# EAGLE schematic PDB (EAGLE 7.6.0)

## Sheet 1 of 2
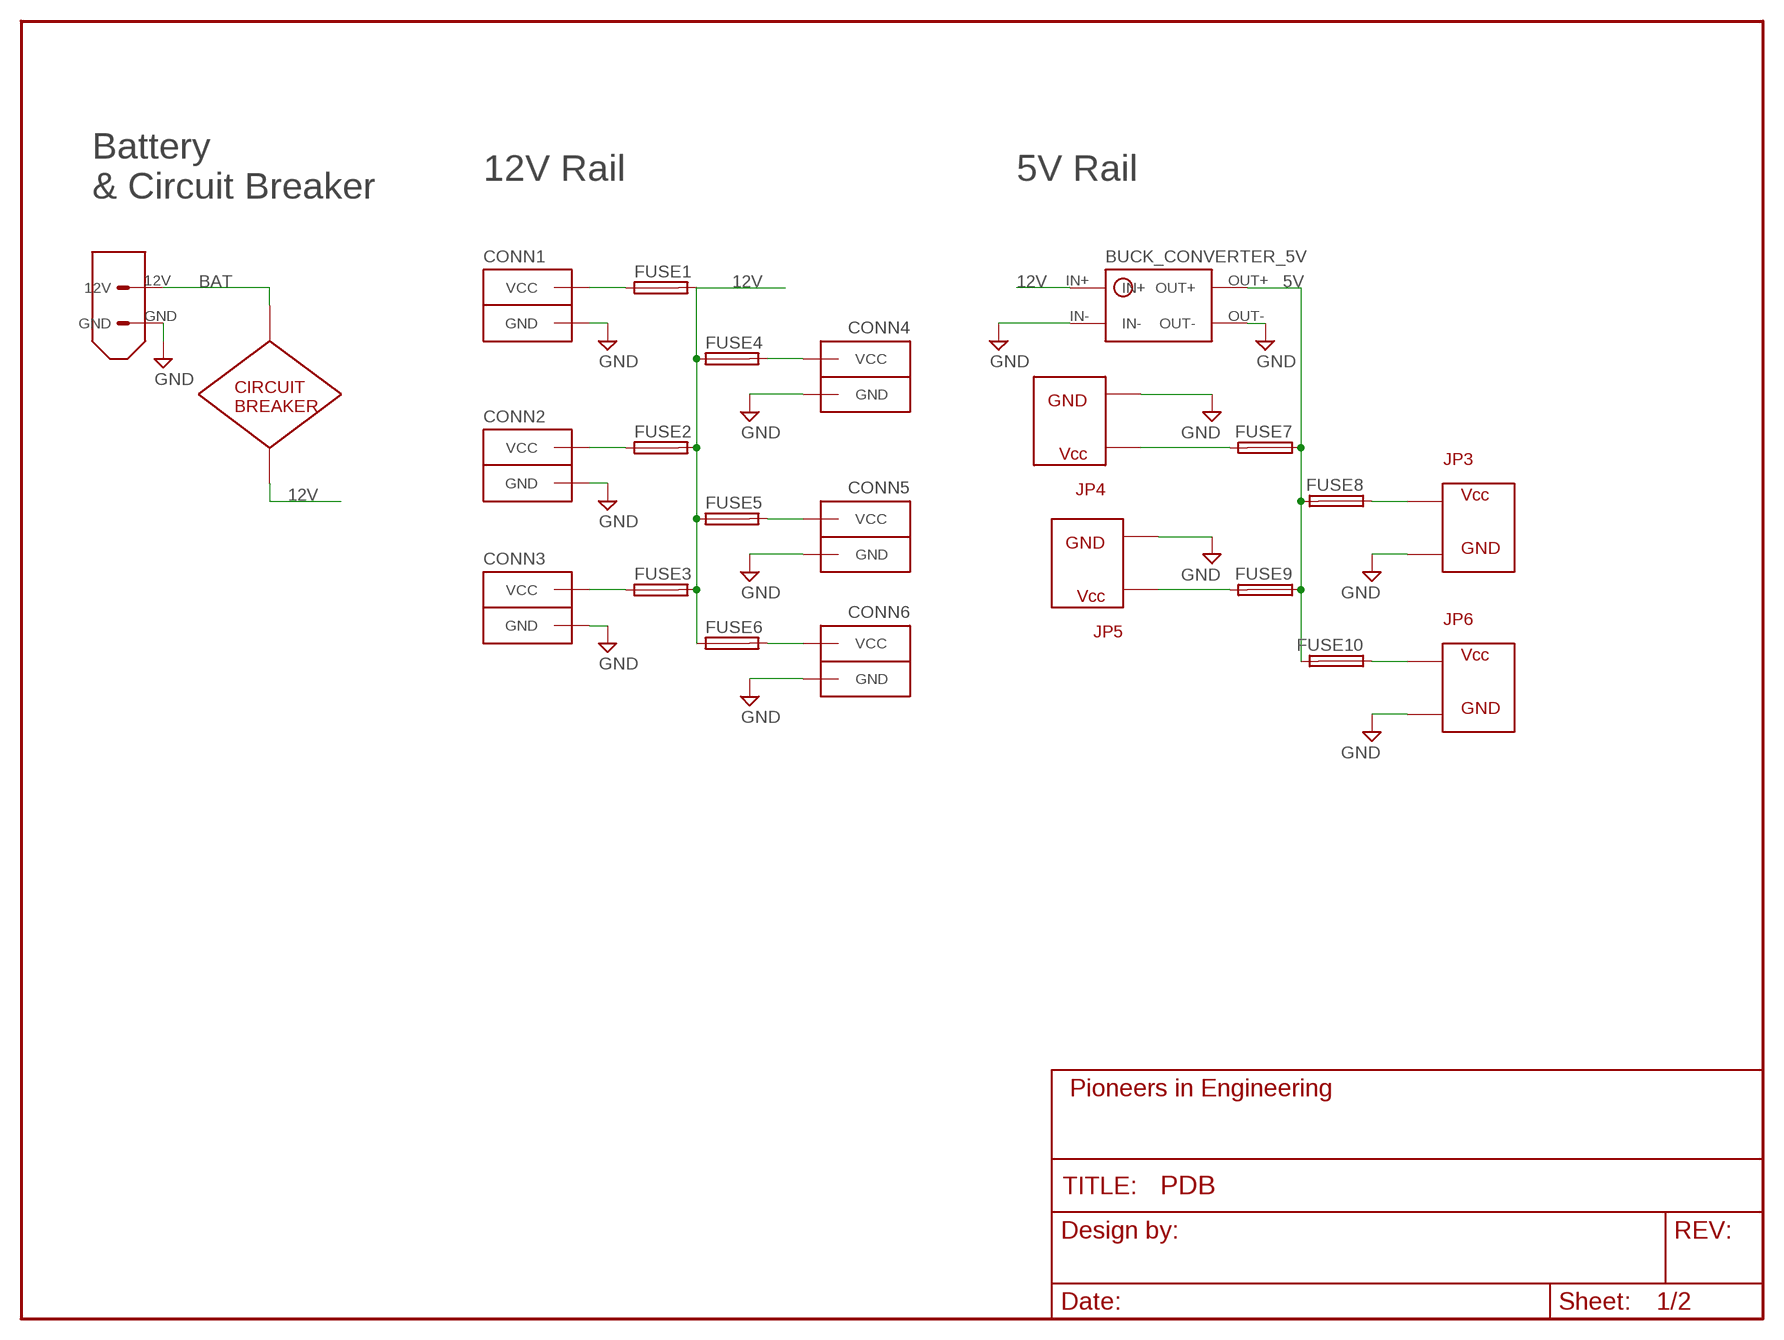
[diagram p0: schematic, sheet 1]
FRAME1 (FRAME_SCHEMATIC): AUTHOR: Mohammed H., Sharabesh R., Tobin H.; REVISION: B

### Parts
CIRCUIT_BREAKER  CIRC_BREAKER  [CIRC_BREAKER]
CONN1  ANDERSONVERTICAL  [ANDERSON_VERTICAL]
CONN2  ANDERSONVERTICAL  [ANDERSON_VERTICAL]
CONN3  ANDERSONVERTICAL  [ANDERSON_VERTICAL]
CONN4  ANDERSONVERTICAL  [ANDERSON_VERTICAL]
CONN5  ANDERSONVERTICAL  [ANDERSON_VERTICAL]
CONN6  ANDERSONVERTICAL  [ANDERSON_VERTICAL]
FUSE1  FUSE_HOLDER_SMD  [FUSE_HOLDER_SMD]
FUSE2  FUSE_HOLDER_SMD  [FUSE_HOLDER_SMD]
FUSE3  FUSE_HOLDER_SMD  [FUSE_HOLDER_SMD]
FUSE4  FUSE_HOLDER_SMD  [FUSE_HOLDER_SMD]
FUSE5  FUSE_HOLDER_SMD  [FUSE_HOLDER_SMD]
FUSE6  FUSE_HOLDER_SMD  [FUSE_HOLDER_SMD]
FUSE7  FUSE_HOLDER_SMD  [FUSE_HOLDER_SMD]
FUSE8  FUSE_HOLDER_SMD  [FUSE_HOLDER_SMD]
FUSE9  FUSE_HOLDER_SMD  [FUSE_HOLDER_SMD]
FUSE10  FUSE_HOLDER_SMD  [FUSE_HOLDER_SMD]
JP3  ATX  [ATX]
JP4  ATX  [ATX]
JP5  ATX  [ATX]
JP6  ATX  [ATX]
U$7  BUCK_CONVERTER_5V  [BUCK_CONVERTER_5V]
XT60  XT60CONNECTOR  [XT60CONNECTOR]

### Nets
5V: FUSE7.P$1_DOWN FUSE7.P$1_UP FUSE8.P$2_DOWN FUSE8.P$2_UP FUSE9.P$1_DOWN FUSE9.P$1_UP FUSE10.P$2_DOWN FUSE10.P$2_UP U$7.OUT+ ; also sheet 2
12V: CIRCUIT_BREAKER.P$2 FUSE1.P$2_DOWN FUSE1.P$2_UP FUSE2.P$2_DOWN FUSE2.P$2_UP FUSE3.P$2_DOWN FUSE3.P$2_UP FUSE4.P$1_DOWN FUSE4.P$1_UP FUSE5.P$1_DOWN FUSE5.P$1_UP FUSE6.P$1_DOWN FUSE6.P$1_UP U$7.IN+
BAT: CIRCUIT_BREAKER.P$1 XT60.12V
GND: CONN1.PIN1(GND) CONN2.PIN1(GND) CONN3.PIN1(GND) CONN4.PIN1(GND) CONN5.PIN1(GND) CONN6.PIN1(GND) JP3.P$2 JP4.P$2 JP5.P$2 JP6.P$2 U$7.IN- U$7.OUT- XT60.GND ; also sheet 2
VOUT1: CONN1.PIN2(VCC) FUSE1.P$1_DOWN FUSE1.P$1_UP
VOUT2: CONN2.PIN2(VCC) FUSE2.P$1_DOWN FUSE2.P$1_UP
VOUT3: CONN3.PIN2(VCC) FUSE3.P$1_DOWN FUSE3.P$1_UP
VOUT4: CONN4.PIN2(VCC) FUSE4.P$2_DOWN FUSE4.P$2_UP
VOUT5: CONN5.PIN2(VCC) FUSE5.P$2_DOWN FUSE5.P$2_UP
VOUT6: CONN6.PIN2(VCC) FUSE6.P$2_DOWN FUSE6.P$2_UP
VOUT7: FUSE7.P$2_DOWN FUSE7.P$2_UP JP4.P$1
VOUT8: FUSE8.P$1_DOWN FUSE8.P$1_UP JP3.P$1
VOUT9: FUSE9.P$2_DOWN FUSE9.P$2_UP JP5.P$1
VOUT10: FUSE10.P$1_DOWN FUSE10.P$1_UP JP6.P$1

### Notes on the sheet
- 12V Rail | 5V Rail
- Battery
  & Circuit Breaker

## Sheet 2 of 2
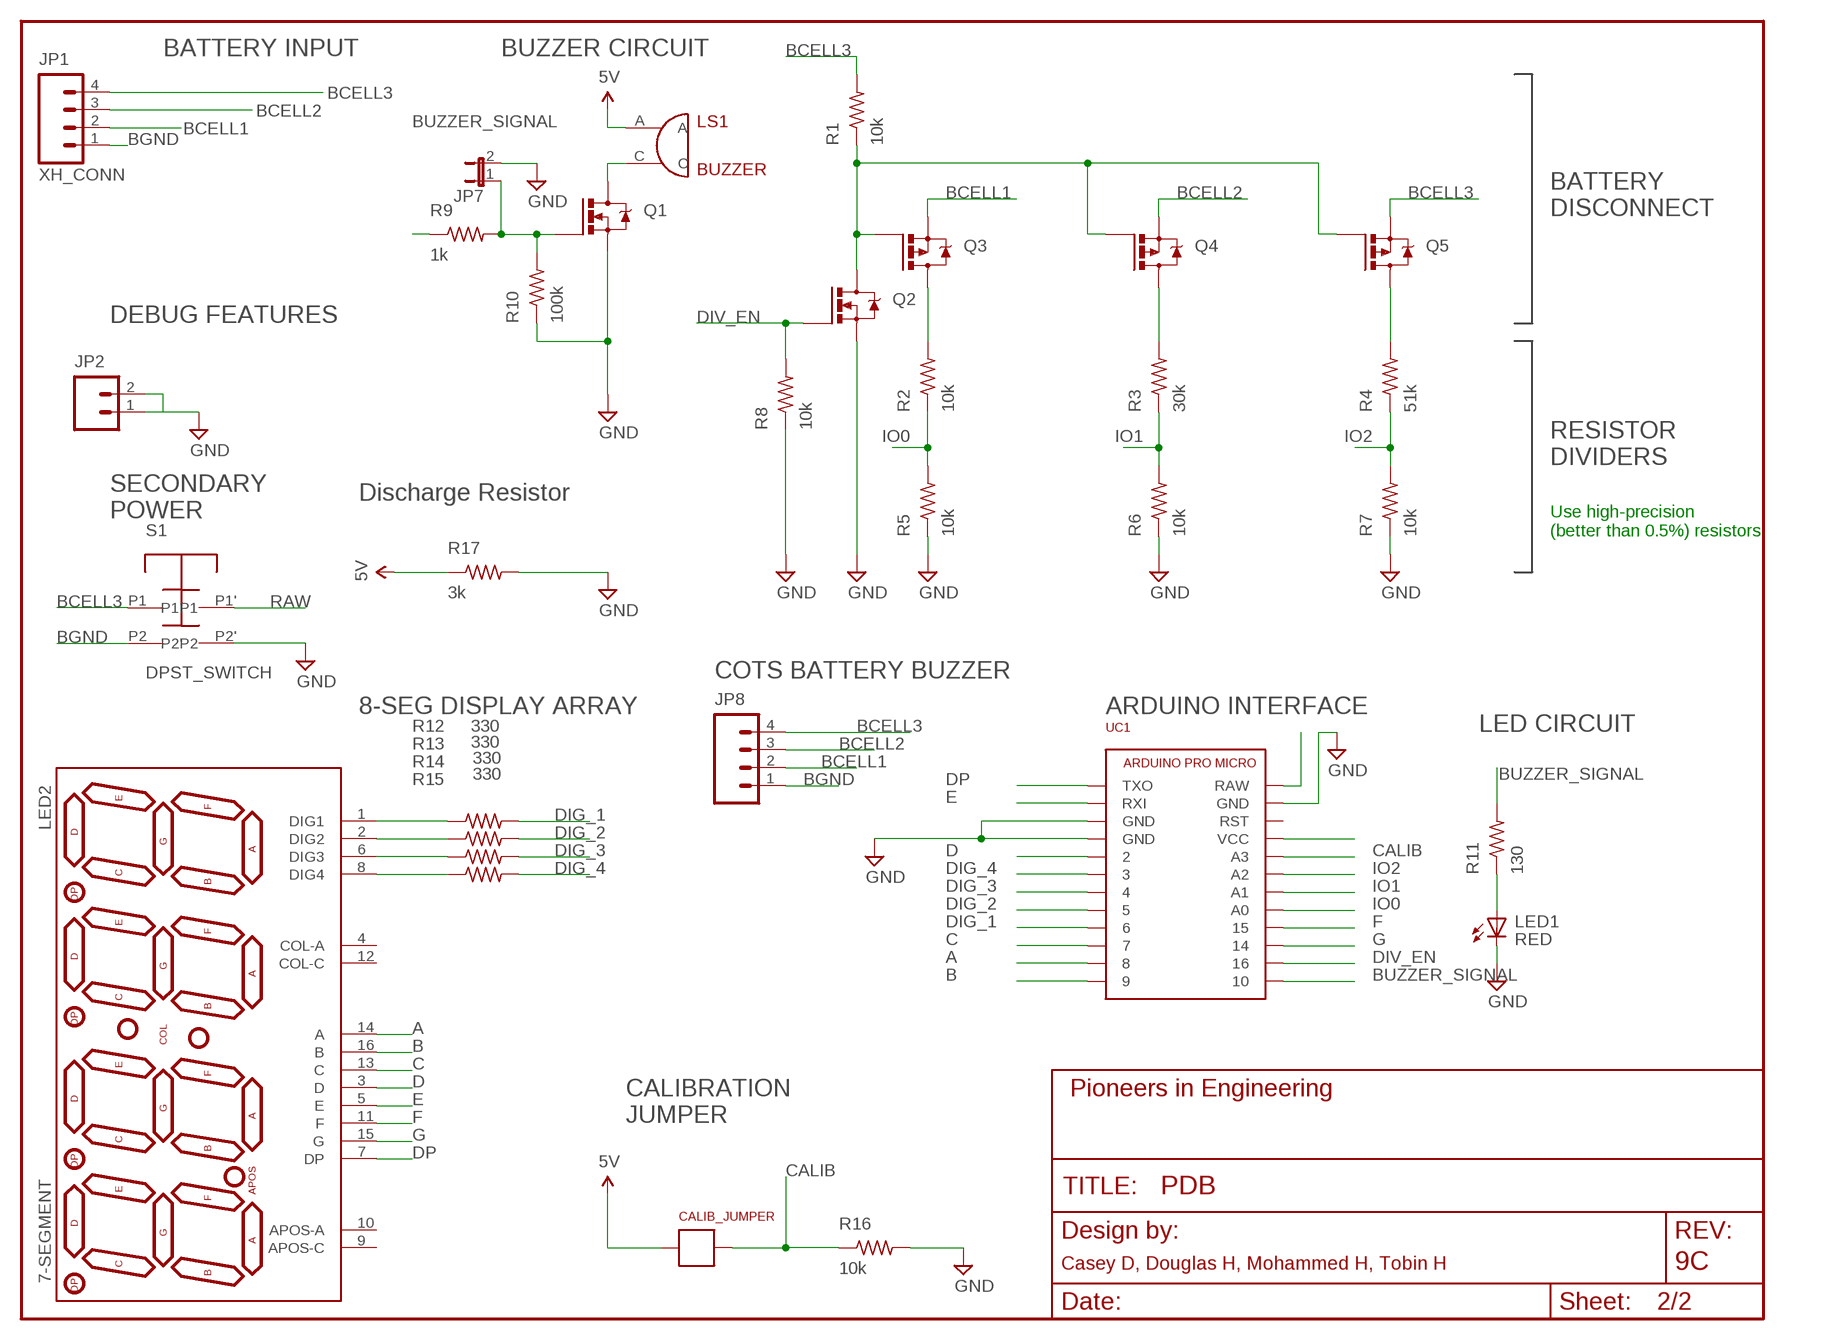
[diagram p1: schematic, sheet 2]
FRAME2 (FRAME_SCHEMATIC): AUTHOR: Casey D, Douglas H, Mohammed H, Tobin H; REVISION: 9C

### Parts
CALIB_JUMPER  JUMPER  [JUMPER]
JP1  XH_CONN  XH_CONNECTOR_4POS  [XH_CONNECTOR_4POS_2.5MM]
JP2  M02PTH  [1X02]
JP7  JP1E  [JP1]
JP8  M04PTH  [1X04]
LED1  RED  LED0805  [LED-0805]
LED2  7-SEGMENT  7-SEGMENT-4DIGIT-YOUNGSUN  [7-SEGMENT-4DIGIT-YOUNGSUN]
LS1  BUZZER  [BUZZER_MAGNETIC_5V_12MM_RADIAL]
Q1  NMOS  N-CHANNEL-MOSFETSOT23-3  [SOT23-3]
Q2  IRFML8244  N-CHANNEL-MOSFETSOT23-3  [SOT23-3]
Q3  PMOS  P-CHANNEL-MOSFETSOT23-3  [SOT23-3]
Q4  PMOS  P-CHANNEL-MOSFETSOT23-3  [SOT23-3]
Q5  PMOS  P-CHANNEL-MOSFETSOT23-3  [SOT23-3]
R1  10k  R-US_R0603  [R0603]
R2  10k  R-US_R0603  [R0603]
R3  30k  R-US_R0603  [R0603]
R4  51k  R-US_R0603  [R0603]
R5  10k  R-US_R0603  [R0603]
R6  10k  R-US_R0603  [R0603]
R7  10k  R-US_R0603  [R0603]
R8  10k  R-US_R0603  [R0603]
R9  1k  R-US_R0603  [R0603]
R10  100k  R-US_R0603  [R0603]
R11  130  R-US_R0603  [R0603]
R12  330  R-US_R0603  [R0603]
R13  330  R-US_R0603  [R0603]
R14  330  R-US_R0603  [R0603]
R15  330  R-US_R0603  [R0603]
R16  10k  R-US_R0603  [R0603]
R17  3k  R-US_R0603  [R0603]
S1  DPST_SWITCH  [C&K_SWITCH]
UC1  ARDUINO_PRO_MICRO  [ARDUINO_PRO_MICRO]

### Nets
5V: CALIB_JUMPER.P$1 LS1.A R17.1 UC1.VCC ; also sheet 1
A: LED2.14(A) UC1.8
B: LED2.16(B) UC1.9
BCELL1: JP1.2 JP8.2 Q3.2(S)
BCELL2: JP1.3 JP8.3 Q4.2(S)
BCELL3: JP1.4 JP8.4 Q5.2(S) R1.2 S1.P1
BGND: JP1.1 JP8.1 S1.P2
BUZZER_SIGNAL: R9.1 R11.2 UC1.10
C: LED2.13(C) UC1.7
CALIB: CALIB_JUMPER.P$2 R16.1 UC1.A3
D: LED2.3(D) UC1.2
DIG_1: R12.2 UC1.6
DIG_2: R13.2 UC1.5
DIG_3: R14.2 UC1.4
DIG_4: R15.2 UC1.3
DIV_EN: Q2.1(G) R8.2 UC1.16
DP: LED2.7(DP) UC1.TXO
E: LED2.5(E) UC1.RXI
F: LED2.11(F) UC1.15
G: LED2.15(G) UC1.14
GND: JP2.1 JP2.2 JP7.2 LED1.C Q1.2(S) Q2.2(S) R5.1 R6.1 R7.1 R8.1 R10.1 R16.2 R17.2 S1.P2' UC1.GND@0(GND) UC1.GND@1(GND) UC1.GND@2(GND) ; also sheet 1
IO0: R2.1 R5.2 UC1.A0
IO1: R3.1 R6.2 UC1.A1
IO2: R4.1 R7.2 UC1.A2
N$1: Q2.3(D) Q3.1(G) Q4.1(G) Q5.1(G) R1.1
N$2: Q3.3(D) R2.2
N$3: Q4.3(D) R3.2
N$4: Q5.3(D) R4.2
N$5: LS1.C Q1.3(D)
N$6: JP7.1 Q1.1(G) R9.2 R10.2
N$7: LED1.A R11.1
N$9: LED2.1(DIG1) R12.1
N$11: LED2.2(DIG2) R13.1
N$13: LED2.6(DIG3) R14.1
N$15: LED2.8(DIG4) R15.1
RAW: S1.P1' UC1.RAW
Unconnected: LED2.4(COL-A) LED2.9(APOS-C) LED2.10(APOS-A) LED2.12(COL-C) UC1.RST

### Notes on the sheet
- BATTERY INPUT | BUZZER CIRCUIT
- BATTERY
  DISCONNECT
- DEBUG FEATURES
- RESISTOR
  DIVIDERS
- Discharge Resistor
- SECONDARY
  POWER
- Use high-precision
  (better than 0.5%) resistors
- COTS BATTERY BUZZER
- 8-SEG DISPLAY ARRAY | ARDUINO INTERFACE
- Connect BCELL3 to RAW, which
  will get regulated on the arduino.
- LED CIRCUIT
- CALIBRATION
  JUMPER

## Library data of the parts
CALIB_JUMPER = pie:JUMPER: 2 Pin Jumper; DESCRIPTION: JUMPER; DISTRIBUTOR: DigiKey; DISTRIBUTOR_PART_NUMBER: 952-2262-ND; MANUFACTURER: Harwin. Inc; MANUFACTURER_PART_NUMBER: M20-9990246; PACKAGE: JP
CIRCUIT_BREAKER = pie:CIRC_BREAKER: PiE Circuit Breaker: product page <http://www.waytekwire.com/item/46977/Bussmann-25550-B-2-Mid-Range-Circuit-Breaker-/>; MANUF: WAYTEK; MANUF-PN: 46977
CONN1-CONN6 = pie:ANDERSON: 2-pin 25A Anderson Connector http://www.alliedelec.com/images/products/datasheets/bm/ANDERSON_POWER_PRODUCTS/70162018.pdf; PIE-INT-REF-NUM: Anderson
FUSE1-FUSE10 = pie:FUSE_HOLDER_SMD: ATC/ATO Fuse Holder. Original variant datasheet <http://keyelco.com/userAssets/file/M65p43.pdf> and Digikey <http://www.digikey.com/product-detail/en/keystone-electronics/3587/36-3587-ND/2137315>; DIGIKEY-PN: 36-3587-ND; MANUF: KEYSTONE; MANUF-PN: 3587
JP1 = pie:XH_CONNECTOR_4POS: 4-pin XH connector (through-hole type shrouded header); PIE-INT-REF-NUM: XH-4POS; PIE_DIGIKEY-PN: 455-2249-ND
JP2 = pie:M02: 2-pin 0.1-inch header and MTA connector; PIE-INT-REF-NUM: BULK-STOCK
JP3-JP6 = pie:ATX: ATX 2 Pin Connector Crimper: http://www.digikey.com/product-detail/en/molex-llc/0640160204/WM17553-ND/2074099 Housing: http://www.digikey.com/product-detail/en/molex-llc/0019092029/WM4382-ND/2421313 Housing (alternative): http://www.digikey.com/product-detail/en/molex-llc/0015311026/WM1041-ND/313614 Connector: http://www.digikey.com/product-detail/en/molex-llc/0019091029/WM1602-ND/26354 Male crimps: http://www.digikey.com/product-detail/en/molex-llc/0002092103/WM1100-ND/26384 Female crimps: http://www.digikey.com/product-detail/en/molex-llc/0002091104/WM1101-ND/26386
JP7 = jumper:JP1E: JUMPER
JP8 = pie:M04: 4-pin 0.1-inch header and MTA connector; PIE-INT-REF-NUM: BULK-STOCK
LED1 = pie:LED: LEDs Standard schematic elements and footprints for 5mm, 3mm, 1206, and 0603 sized LEDs. 5mm - Spark Fun Electronics SKU : COM-00529 (and others); PIE-INT-REF-NUM: LED
LED2 = pie:7-SEGMENT-4DIGIT-YOUNGSUN: This is a part for the 4-Digit 7-segment LEDs from Young Sun. Different from the Digikey LEDs, all 16 pins are used. The LONGPADS Variant is used for a test jig, but you may like it because there is more pad to solder to. If you are concerned about routing space, the standard works just fine though.
LS1 = pie:BUZZER: Buzzer; PIE-INT-REF-NUM: BUZZER; PIE_DIGIKEY-PN: 102-1269-ND
Q1 Q2 = pie:N-CHANNEL-MOSFET: N-channel TrenchMOS (TM) logic level FET Source: SOT23-3: http://www.nxp.com/documents/data_sheet/BSS123.pdf SOT669: http://www.nxp.com/documents/data_sheet/PH7030L.pdf
Q3-Q5 = pie:P-CHANNEL-MOSFET: P-Channel PowerTrench® MOSFET Source: FDD4141.pdf; PIE-DIGIKEY-PN-PRI: IRLML6402PBFCT-ND; PIE-INT-REF-NUM: PMOS
R1-R17 = pie:R-US_: RESISTOR, American symbol; PIE-INT-REF-NUM: RESISTOR-GENERIC
S1 = pie:DPST_SWITCH: Double Throw, single pole normally open pushbutton switch. 401-1133-ND
U$7 = pie:BUCK_CONVERTER_5V: 5V Buck Converter. For PDB. Product Detail <https://www.amazon.com/dp/B00GQ032DK/?psc=1>
UC1 = pie:ARDUINO_PRO_MICRO: Arduino Pro Micro Electrical System Year 9's Smart Sensor Core Pin Outs <https://cdn.sparkfun.com/assets/9/c/3/c/4/523a1765757b7f5c6e8b4567.png> Buy Here <http://www.aliexpress.com/item/Mini-Leonardo-Pro-Micro-ATmega32U4-5V-16MHz-Module-For-Arduino-Best-Quality/32284746884.html?ws_ab_test=searchweb201556_8,searchweb201602_2_10057_10056_10065_10055_10054_10067_10069_10059_10058_10017_10070_10060_10061_10052_10062_10053_10050_10051,searchweb201603_1&btsid=45993952-29ca-4de4-a0fb-c7fb72b8e1a5> Thru Hole Female Pins <http://www.digikey.com/product-search/en?keywords=929974E-01-12-ND> Surface Mount Female Pins <http://www.digikey.com/product-detail/en/sullins-connector-solutions/NPTC121KFXC-RC/S5604-ND/776062>; DESCRIPTION: Arduino Pro Micro; DISTRIBUTOR: AliExpress; DISTRIBUTOR_PART_NUMBER: 32284746884; MANUFACTURER: Feiyang electronics; NOTES: https://www.aliexpress.com/item/Mini-Leonardo-Pro-Micro-ATmega32U4-5V-16MHz-Module-For-Arduino-Best-Quality/32284746884.html?ws_ab_test=searchweb201556_8,searchweb201602_2_10057_10056_10065_10055_10054_10067_10069_10059_10058_10017_10070_10060_10061_10052_10062_10053_10050_10051,searchweb201603_1&btsid=45993952-29ca-4de4-a0fb-c7fb72b8e1a5; PACKAGE: ARDUINO_PRO_MICRO; REFERENCE_DEST: ARDUINO_PRO_MICRO
XT60 = pie:XT60CONNECTOR: 12V XT60 power connector; PARTNUMBER: PRT-10474